# EAGLE design FLYTE-v1 (EAGLE 9.6.2)
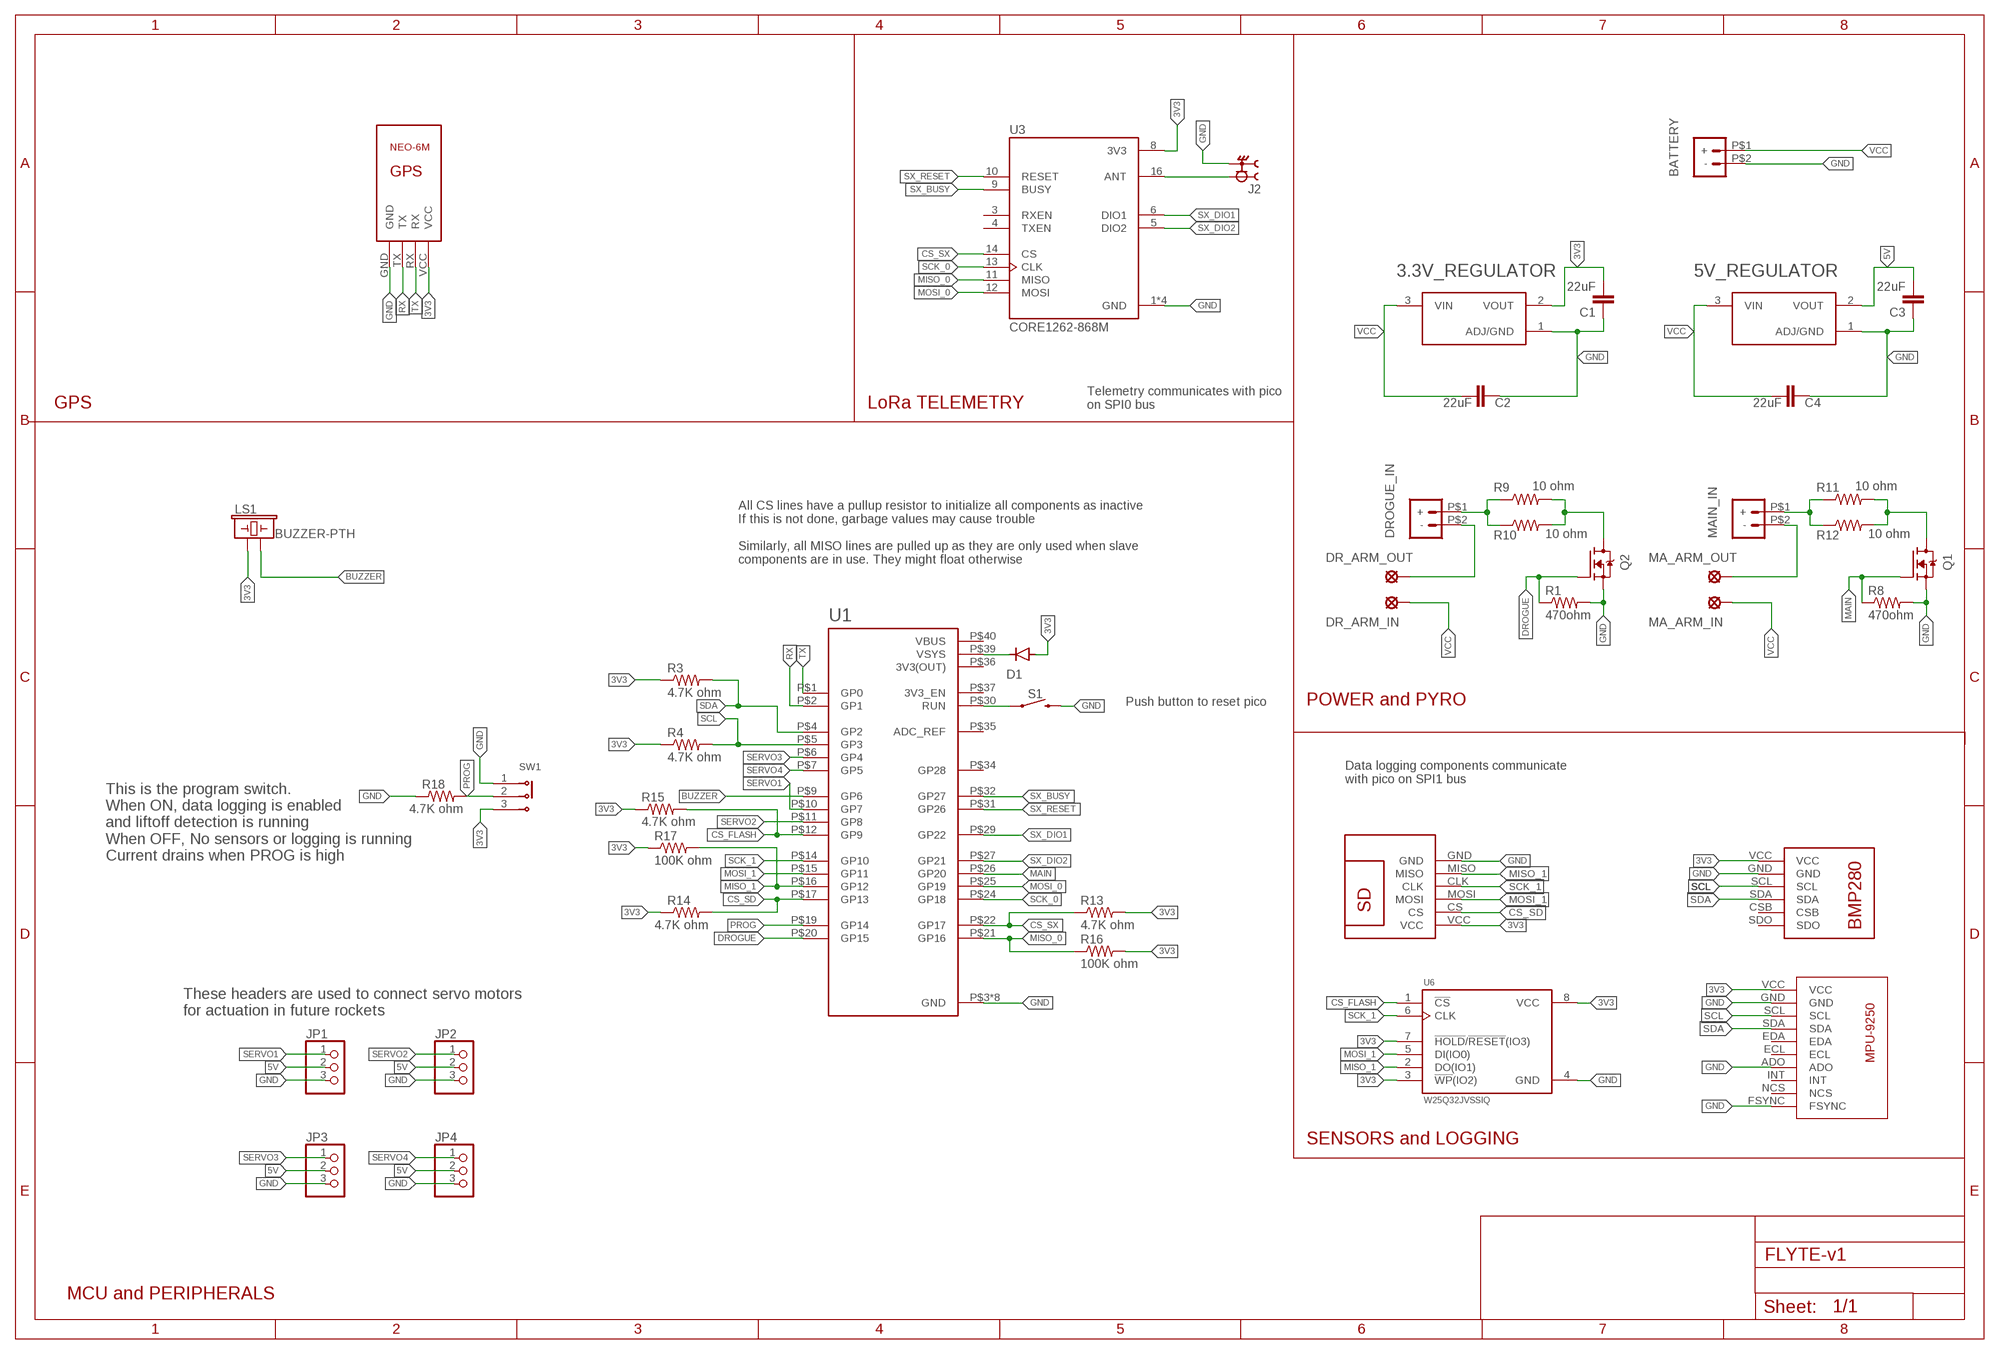
[diagram p0: schematic, sheet 1]

## Parts
3.3V_REGULATOR  AMS1117-3.3  [SOT229P700X180-4N]
5V_REGULATOR  AMS1117-3.3  [SOT229P700X180-4N]
BATTERY  XT30UPB-M  [XT30UPB-M]
C1  22uF  22UF-0805-6.3V-20%  [0805]
C2  22uF  22UF-0805-6.3V-20%  [0805]
C3  22uF  22UF-0805-6.3V-20%  [0805]
C4  22uF  22UF-0805-6.3V-20%  [0805]
D1  1N4004  [DO41-10]
DR_ARM_IN  LSP10  [LSP10]
DR_ARM_OUT  LSP10  [LSP10]
DROGUE_IN  XT30UPB-M  [XT30UPB-M]
J2  CONSMA002  [LINX_CONSMA002]
JP1  PINHD-1X3  [1X03]
JP2  PINHD-1X3  [1X03]
JP3  PINHD-1X3  [1X03]
JP4  PINHD-1X3  [1X03]
LS1  BUZZER-PTH  [BUZZER-12MM]
MA_ARM_IN  LSP10  [LSP10]
MA_ARM_OUT  LSP10  [LSP10]
MAIN_IN  XT30UPB-M  [XT30UPB-M]
Q1  IRF540NPBF  [TO254P1054X469X1930-3]
Q2  IRF540NPBF  [TO254P1054X469X1930-3]
R1  470ohm  R-US_R0805  [R0805]
R3  4.7K ohm  R-US_R0805  [R0805]
R4  4.7K ohm  R-US_R0805  [R0805]
R8  470ohm  R-US_R0805  [R0805]
R9  10 ohm  R-US_0207/10  [0207/10]
R10  10 ohm  R-US_0207/10  [0207/10]
R11  10 ohm  R-US_0207/10  [0207/10]
R12  10 ohm  R-US_0207/10  [0207/10]
R13  4.7K ohm  R-US_R0805  [R0805]
R14  4.7K ohm  R-US_R0805  [R0805]
R15  4.7K ohm  R-US_R0805  [R0805]
R16  100K ohm  R-US_R0805  [R0805]
R17  100K ohm  R-US_R0805  [R0805]
R18  4.7K ohm  R-US_R0805  [R0805]
S1  MOMENTARY-SWITCH-SPST-PTH-6.0MM  [TACTILE_SWITCH_PTH_6.0MM]
SW1  1825159-1  [SW_1825159-1]
U1  RASPBERRY_PICO-NO_DEBUG  [PICO-PKG-NO_DEBUG]
U3  CORE1262-868M  [XCVR_CORE1262-868M]
U6  W25Q32JVSSIQ  [SOIC127P790X216-8N]
U$1  BMP280  [BMP280]
U$2  GY-9250  [GY-9250]
U$3  SDREADER  [SDREADER]
U$4  NEO-6M  [NEO-6M]

## Nets
3V3: 3.3V_REGULATOR.2(VOUT) C1.2 D1.A LS1.+ R3.1 R4.1 R13.2 R14.1 R15.1 R16.2 R17.1 SW1.3 U3.8(3V3) U6.3(!WP!(IO2)) U6.7(!HOLD!/!RESET!(IO3)) U6.8(VCC) U$1.VCC U$2.VCC U$3.VCC U$4.VCC
5V: 5V_REGULATOR.2(VOUT) C3.2 JP1.2 JP2.2 JP3.2 JP4.2
ANT: J2.1 U3.16(ANT)
BUZZER: LS1.- U1.P$9(GP6)
CS_FLASH: R15.2 U1.P$12(GP9) U6.1(!CS)
CS_SD: R14.2 U1.P$17(GP13) U$3.CS
CS_SX: R13.1 U1.P$22(GP17) U3.14(CS)
DROGUE: Q2.1(G) R1.1 U1.P$20(GP15)
GND: 3.3V_REGULATOR.1(ADJ/GND) 5V_REGULATOR.1(ADJ/GND) BATTERY.P$2(-) C1.1 C2.1 C3.1 C4.1 J2.S1 J2.S2 J2.S3 J2.S4 JP1.3 JP2.3 JP3.3 JP4.3 Q1.3(S) Q2.3(S) R1.2 R8.2 R18.1 S1.3 SW1.1 U1.P$3(GND) U1.P$8(GND) U1.P$13(GND) U1.P$18(GND) U1.P$23(GND) U1.P$28(GND) U1.P$33(GND) U1.P$38(GND) U3.1(GND) U3.2(GND) U3.7(GND) U3.15(GND) U6.4(GND) U$1.GND U$2.ADO U$2.FSYNC U$2.GND U$3.GND U$4.GND
MAIN: Q1.1(G) R8.1 U1.P$26(GP20)
MISO_0: R16.1 U1.P$21(GP16) U3.11(MISO)
MISO_1: R17.2 U1.P$16(GP12) U6.2(DO(IO1)) U$3.MISO
MOSI_0: U1.P$25(GP19) U3.12(MOSI)
MOSI_1: U1.P$15(GP11) U6.5(DI(IO0)) U$3.MOSI
N$1: D1.C U1.P$39(VSYS)
N$2: DR_ARM_OUT.MP DROGUE_IN.P$2(-)
N$6: MAIN_IN.P$1(+) R11.1 R12.1
N$7: DROGUE_IN.P$1(+) R9.1 R10.1
N$8: S1.1 U1.P$30(RUN)
N$12: Q2.2(D) R9.2 R10.2
N$13: Q1.2(D) R11.2 R12.2
N$14: MA_ARM_OUT.MP MAIN_IN.P$2(-)
PROG: R18.2 SW1.2 U1.P$19(GP14)
RX: U1.P$2(GP1) U$4.TX
SCK_0: U1.P$24(GP18) U3.13(CLK)
SCK_1: U1.P$14(GP10) U6.6(CLK) U$3.CLK
SCL: R4.2 U1.P$5(GP3) U$1.SCL U$2.SCL
SDA: R3.2 U1.P$4(GP2) U$1.SDA U$2.SDA
SERVO1: JP1.1 U1.P$10(GP7)
SERVO2: JP2.1 U1.P$11(GP8)
SERVO3: JP3.1 U1.P$6(GP4)
SERVO4: JP4.1 U1.P$7(GP5)
SX_BUSY: U1.P$32(GP27) U3.9(BUSY)
SX_DIO1: U1.P$29(GP22) U3.6(DIO1)
SX_DIO2: U1.P$27(GP21) U3.5(DIO2)
SX_RESET: U1.P$31(GP26) U3.10(RESET)
TX: U1.P$1(GP0) U$4.RX
VCC: 3.3V_REGULATOR.3(VIN) 5V_REGULATOR.3(VIN) BATTERY.P$1(+) C2.2 C4.2 DR_ARM_IN.MP MA_ARM_IN.MP
Unconnected: U1.P$34(GP28) U1.P$35(ADC_REF) U1.P$37(3V3_EN) U3.3(RXEN) U3.4(TXEN) U$1.CSB U$1.SDO U$2.ECL U$2.EDA U$2.INT U$2.NCS

## Notes on the sheet
- GPS | LoRa TELEMETRY
- Telemetry communicates with pico 
  on SPI0 bus
- All CS lines have a pullup resistor to initialize all components as inactive
  If this is not done, garbage values may cause trouble
  
  Similarly, all MISO lines are pulled up as they are only used when slave
  components are in use. They might float otherwise
- Push button to reset pico | POWER and PYRO
- Data logging components communicate 
  with pico on SPI1 bus
- This is the program switch.
  When ON, data logging is enabled 
  and liftoff detection is running
  When OFF, No sensors or logging is running
  Current drains when PROG is high
- These headers are used to connect servo motors 
  for actuation in future rockets
- SENSORS and LOGGING
- MCU and PERIPHERALS

## Power pins joined to a net without a drawn wire
3V3(OUT): U1.P$36(3V3(OUT))
VBUS: U1.P$40(VBUS)

## Library data of the parts
3.3V_REGULATOR 5V_REGULATOR = AMS1117-3.3:AMS1117-3.3: Sot223/Pkg 1-Amp 3.3-Volt Low Drop Out Voltage Regulatator Check availability <https://pricing.snapeda.com/parts/AMS1117-3.3/Advanced%20Monolithic%20Systems/view-part?ref=eda>; AVAILABILITY: Not in stock; DESCRIPTION: Sot223/Pkg 1-Amp 3.3-Volt Low Drop Out Voltage Regulatator; MF: Advanced Monolithic Systems; MP: AMS1117-3.3; PACKAGE: SOT-223 Seeed Technology; PRICE: None
BATTERY DROGUE_IN MAIN_IN = XT30UPB-M:XT30UPB-M: Check availability <https://pricing.snapeda.com/parts/XT30UPB-M/amass/view-part?ref=eda>; AVAILABILITY: Not in stock; DESCRIPTION: Socket; DC supply; XT30; male; PIN: 2; on PCBs; THT; yellow; 15A; 500V; MF: amass; MP: XT30UPB-M; PACKAGE: None; PRICE: None
C1-C4 = SparkFun-Capacitors:22UF: 22µF ceramic capacitors A capacitor is a passive two-terminal electrical component used to store electrical energy temporarily in an electric field.; PROD_ID: CAP-08402
D1 = diode:1N4004: DIODE general purpose rectifier, 1 A
DR_ARM_IN DR_ARM_OUT MA_ARM_IN MA_ARM_OUT = solpad:LSP10: SOLDER PAD drill 1.0 mm, distributor Buerklin, 12H555
J2 = CONSMA002:CONSMA002: Check availability <https://pricing.snapeda.com/parts/CONSMA002/Linx/view-part?ref=eda>; AVAILABILITY: In Stock; DESCRIPTION: SMA Connector Receptacle, Female Socket 50Ohm Through Hole, Right Angle Solder; MF: Linx; MP: CONSMA002; PACKAGE: None; PRICE: None; PURCHASE-URL: https://pricing.snapeda.com/search/part/CONSMA002/?ref=eda
JP1-JP4 = adafruit:PINHD-1X3: PIN HEADER
LS1 = SparkFun-Electromechanical:BUZZER: Buzzer Small round buzzers that operate around the audible 2kHz range. You can use these as speakers to create simple music or user interfaces. Variant Overview: PTH - Mini Speaker - PC Mount 12mm 2.048kHz <https://www.sparkfun.com/products/7950> PTH_KIT - Mini Speaker - PC Mount 12mm 2.048kHz <https://www.sparkfun.com/products/7950> KIT simplifies soldering by adding stop mask to one side of the pads. PTH_NO_SILK - Mini Speaker - PC Mount 12mm 2.048kHz <https://www.sparkfun.com/products/7950> No silkscreen indicator of buzzer outline. PTH_KIT_NO_SILK - Mini Speaker - PC Mount 12mm 2.048kHz <https://www.sparkfun.com/products/7950> KIT package w/o silkscreen SMD - Buzzer Audio Magnetic (CCV-084B16) SMD buzzer used on, e.g. the LilyPad Buzzer <https://www.sparkfun.com/products/8463> and RFID USB Reader <https://www.sparkfun.com/products/9963>. SMD_KIT - Buzzer Audio Magnetic (CCV-084B16) SMD Buzzer with elongated pins to make soldering easier. Used on the SparkFun Simon Says - Surface Mount Soldering Kit <https://www.sparkfun.com/products/10935>. SMD-SQUARE - Buzzer Audio Magnetic (COMP-15701) SMT square buzzer with one chamfered corner.; PROD_ID: COMP-08253; SF_SKU: COM-07950
Q1 Q2 = IRF540NPBF:IRF540NPBF: Check availability <https://pricing.snapeda.com/parts/IRF540NPBF/Infineon/view-part?ref=eda>; AVAILABILITY: In Stock; DESCRIPTION: RoHS Compliant | Low RDS(on) | Industry-leading quality | Dynamic dv/dt Rating | Fast Switching | Fully Avalanche Rated | 175C Operating Temperature; MF: Infineon; MP: IRF540NPBF; PACKAGE: TO-220 Infineon; PRICE: None; PURCHASE-URL: https://pricing.snapeda.com/search/part/IRF540NPBF/?ref=eda
R1 R3 R4 R8-R18 = rcl:R-US_: RESISTOR, American symbol; SPICEPREFIX: R
S1 = SparkFun-Switches:MOMENTARY-SWITCH-SPST: Momentary Switch (Pushbutton) - SPST Normally-open (NO) SPST momentary switches (buttons, pushbuttons). Variants PTH-12MM - 12mm square, through-hole Momentary Pushbutton Switch - 12mm Square <https://www.sparkfun.com/products/9190> (COM-09190) PTH-6.0MM, PTH-6.0MM-KIT - 6.0mm square, through-hole Mini Pushbutton Switch <https://www.sparkfun.com/products/97> (COM-00097) KIT package intended for soldering kit's - only one side of pads' copper is exposed. PTH-RIGHT-ANGLE-KIT - Right-angle, through-hole Right Angle Tactile Button <https://www.sparkfun.com/products/10791> - Used on SparkFun BigTime Watch Kit <https://www.sparkfun.com/products/11734> SMD-12MM - 12mm square, surface-mount Tactile Button - SMD (12mm) <https://www.sparkfun.com/products/12993> (COM-12993) Used on SparkFun PicoBoard <https://www.sparkfun.com/products/11888> SMD-4.5MM - 4.5mm Square Trackball Switch Used on SparkFun Blackberry Trackballer Breakout <https://www.sparkfun.com/products/13169> SMD-4.6MMX2.8MM - 4.60mm x 2.80mm, surface mount Used on SparkFun Pro Micro - RP2040 <https://www.sparkfun.com/products/17717> SMD-5.2MM, SMD-5.2-REDUNDANT - 5.2mm square, surface-mount Mini Pushbutton Switch - SMD <https://www.sparkfun.com/products/8720> (COM-08720) Used on Arduino Pro Mini <https://www.sparkfun.com/products/11114> REDUNDANT package connects both switch circuits together SMD-6.0X3.5MM - 6.0 x 3.5mm, surface mount Momentary Reset Switch SMD <https://www.sparkfun.com/products/8229> (COM-08229) SMD-6.2MM-TALL - 6.2mm square, surface mount Tactile Button - SMD (6mm) <https://www.sparkfun.com/products/12992> Used on SparkFun Digital Sandbox <https://www.sparkfun.com/products/12651> SMD-RIGHT-ANGLE - Right-angle, surface mount Used on SparkFun Block for Intel® Edison - Arduino <https://www.sparkfun.com/products/13036>; PROD_ID: SWCH-08441; SF_SKU: COM-00097
SW1 = 1825159-1:1825159-1: SWITCH SLIDE SPDT 300MA 125V Check availability <https://pricing.snapeda.com/parts/1825159-1/TE%20Connectivity/view-part?ref=eda>; AVAILABILITY: In Stock; COMMENT: 1825159-1; CONFIGURATION_POLE-THROW: Single Pole - Double Throw; CONTACT_CURRENT_RATING: .25 A; DESCRIPTION: Slide Switch SPDT Through Hole; EU_ROHS_COMPLIANCE: Compliant; MF: TE Connectivity; MP: 1825159-1; PACKAGE: None; PRICE: None; PURCHASE-URL: https://pricing.snapeda.com/search/part/1825159-1/?ref=eda; SWITCH_TYPE: Slide
U1 = RpiPico:RASPBERRY_PICO-NO_DEBUG
U3 = CORE1262-868M:CORE1262-868M: Check availability <https://pricing.snapeda.com/parts/Core1262-868M/Waveshare%20Electronics/view-part?ref=eda>; AVAILABILITY: Not in stock; DESCRIPTION: Lora core module; MF: Waveshare Electronics; MP: Core1262-868M; PACKAGE: Package; PRICE: None
U6 = W25Q32JVSSIQ:W25Q32JVSSIQ: NOR Flash Serial-SPI 3V/3.3V 32M-bit 4M x 8 8.5ns 8-Pin SOIC Check availability <https://pricing.snapeda.com/parts/W25Q32JVSSIQ/Winbond/view-part?ref=eda>; AVAILABILITY: In Stock; DESCRIPTION: FLASH - NOR Memory IC 32Mb (4M x 8) SPI - Quad I/O 133 MHz 8-SOIC; MF: Winbond; MP: W25Q32JVSSIQ; PACKAGE: SOIC-8 Winbond; PRICE: None; PURCHASE-URL: https://pricing.snapeda.com/search/part/W25Q32JVSSIQ/?ref=eda
U$1 = BMP280:BMP280
U$2 = GY-9250:GY-9250
U$3 = SDREADER:SDREADER
U$4 = NEO-6M:NEO-6M

## Board
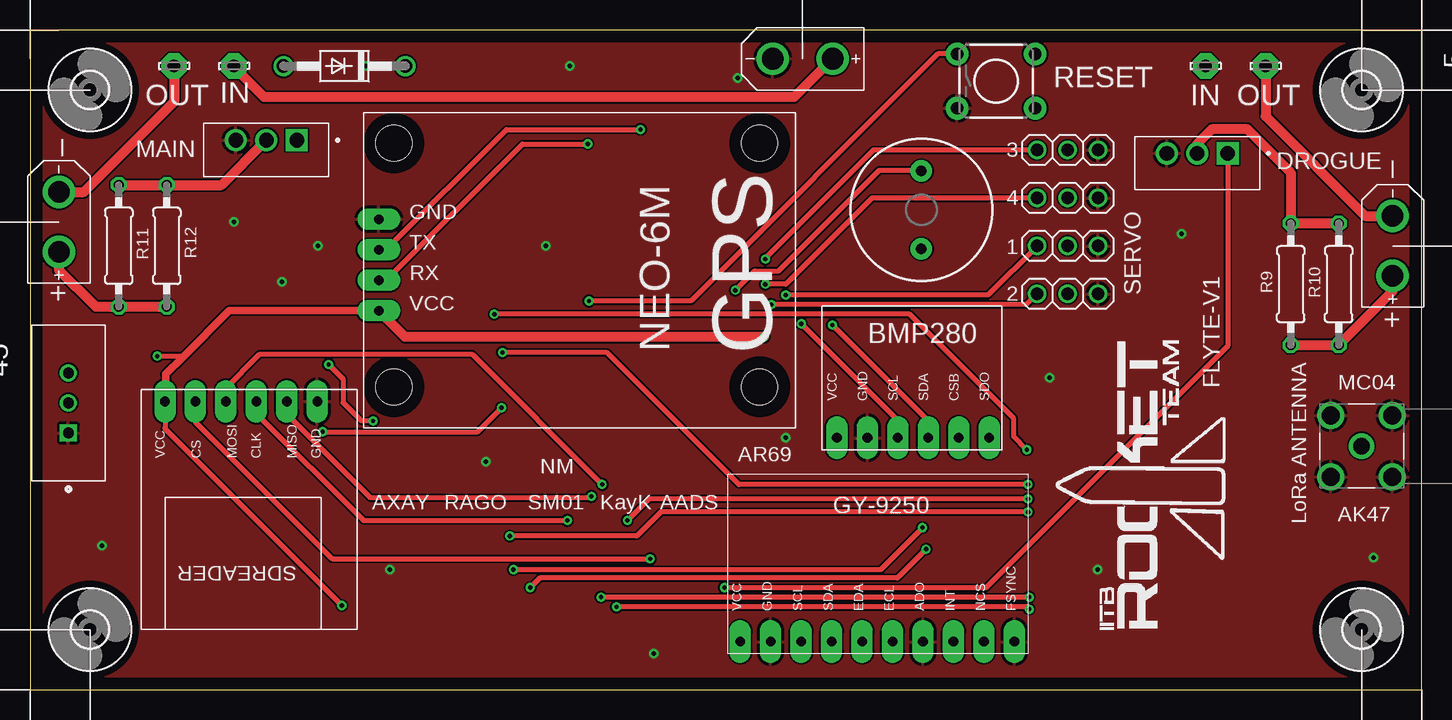
[diagram p1: board, top side]
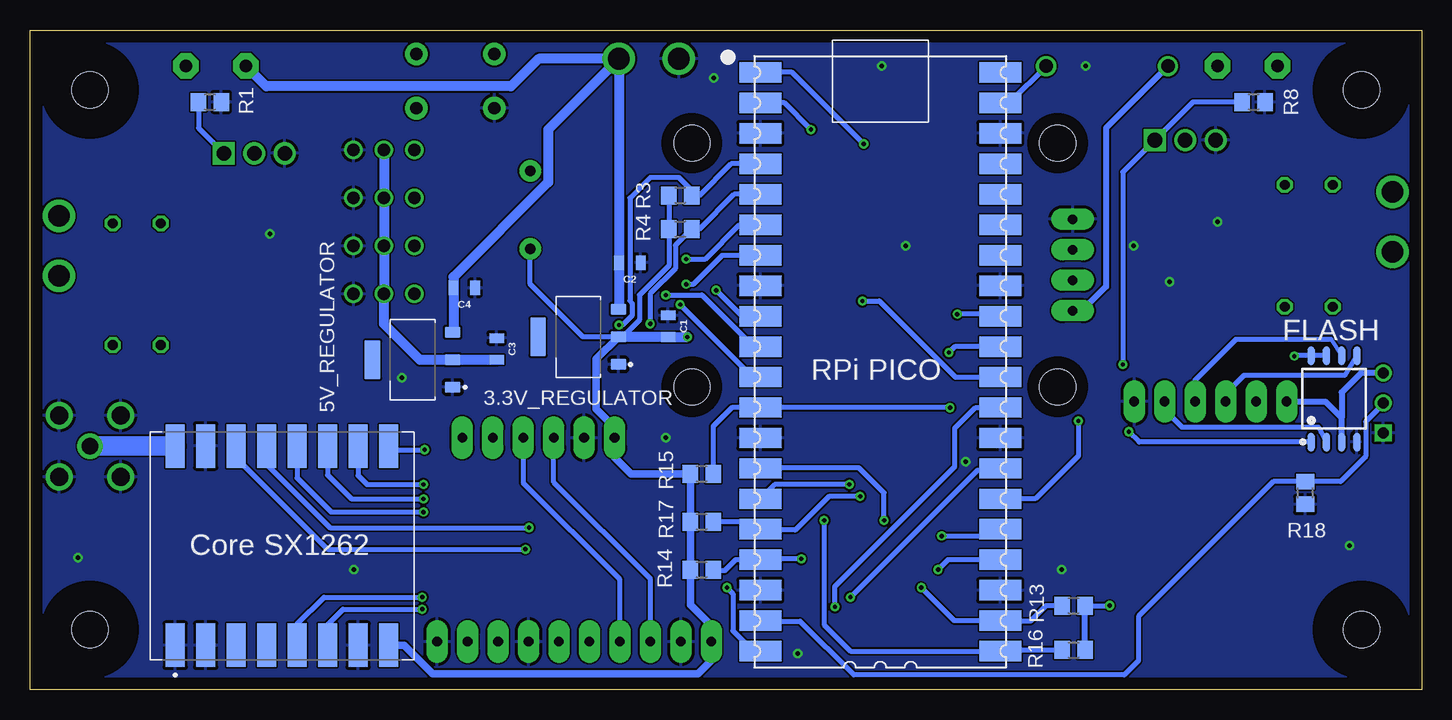
[diagram p2: board, bottom side, seen from below]

Size 116 x 55 mm. Coordinates in mm from the lower left corner, seen from the top.
Outline: 0,0 116,0 116,55 0,55 0,0
Copper layers (1*16): Top 0.035mm / dielectric 1.5mm / Bottom 0.035mm
Design rules "default": minimum track width 6mil, minimum drill 0.35mm, track to track 6mil, track to pad 6mil, pad to pad 6mil, via to via 6mil, smd to smd 6mil, copper to edge 40mil, drill to drill 6mil, minimum pad ring 10mil, minimum via ring 8mil, stop-mask expansion 4mil, vias tented up to drill 0mil, thermal gap 10mil

### Footprints (pad centres in the part's own frame; a part is rotated, then mirrored left to right if it is on the bottom)
SOT229P700X180-4N = smd 0.93 x 1.31: 1 -2.29,-3.345; 2 0,-3.345; 3 2.29,-3.345 | smd 3.24 x 1.31: 4 0,3.345
XT30UPB-M = drill 1.8: P$1 -2.5,0; P$2 2.5,0
0805 = smd 0.8 x 1.2: 1 -0.9,0; 2 0.9,0
DO41-10 = drill 1.118: A 5.08,0; C -5.08,0
LSP10 = drill 1.016 pad 2.159 octagon: MP 0,0
LINX_CONSMA002 = drill 1.4: 1 0,0 | drill 1.5: S1 -2.55,2.55; S2 -2.55,-2.55; S3 2.55,-2.55; S4 2.55,2.55
1X03 = drill 1.016: 1 -2.54,0; 2 0,0; 3 2.54,0
BUZZER-12MM = drill 0.9 pad 1.778: + 3.25,0; - -3.25,0
TO254P1054X469X1930-3 = drill 1.23 square: 1 -2.54,-0.81 | drill 1.23: 2 0,-0.81; 3 2.54,-0.81
R0805 = smd 1.3 x 1.5: 1 -0.95,0; 2 0.95,0
0207/10 = drill 0.813 octagon: 1 -5.08,0; 2 5.08,0
TACTILE_SWITCH_PTH_6.0MM = drill 1.016 pad 1.88: 1 -3.251,2.261; 2 3.251,2.261; 3 -3.251,-2.261; 4 3.251,-2.261
SW_1825159-1 = drill 0.9 square: 1 -2.5,0 | drill 0.9: 2 0,0; 3 2.5,0
PICO-PKG-NO_DEBUG = smd 3.5 x 1.7: P$1 -8.73,25.4; P$2 -8.73,22.86; P$3 -8.73,20.32; P$4 -8.73,17.78; P$5 -8.73,15.24; P$6 -8.73,12.7; P$7 -8.73,10.16; P$8 -8.73,7.62; P$9 -8.73,5.08; P$10 -8.73,2.54; P$11 -8.73,0; P$12 -8.73,-2.54; P$13 -8.73,-5.08; P$14 -8.73,-7.62; P$15 -8.73,-10.16; P$16 -8.73,-12.7; P$17 -8.73,-15.24; P$18 -8.73,-17.78; P$19 -8.73,-20.32; P$20 -8.73,-22.86; P$21 11.27,-22.86; P$22 11.27,-20.32; P$23 11.27,-17.78; P$24 11.27,-15.24; P$25 11.27,-12.7; P$26 11.27,-10.16; P$27 11.27,-7.62; P$28 11.27,-5.08; P$29 11.27,-2.54; P$30 11.27,0; P$31 11.27,2.54; P$32 11.27,5.08; P$33 11.27,7.62; P$34 11.27,10.16; P$35 11.27,12.7; P$36 11.27,15.24; P$37 11.27,17.78; P$38 11.27,20.32; P$39 11.27,22.86; P$40 11.27,25.4
XCVR_CORE1262-868M = smd 3.61 x 1.61: 1 -8.3,8.89; 2 -8.3,6.35; 3 -8.3,3.81; 4 -8.3,1.27; 5 -8.3,-1.27; 6 -8.3,-3.81; 7 -8.3,-6.35; 8 -8.3,-8.89; 9 8.3,-8.89; 10 8.3,-6.35; 11 8.3,-3.81; 12 8.3,-1.27; 13 8.3,1.27; 14 8.3,3.81; 15 8.3,6.35; 16 8.3,8.89
SOIC127P790X216-8N = smd 1.6 x 0.6: 1 -3.6,1.905; 2 -3.6,0.635; 3 -3.6,-0.635; 4 -3.6,-1.905; 5 3.6,-1.905; 6 3.6,-0.635; 7 3.6,0.635; 8 3.6,1.905
BMP280 = drill 0.8 pad 1.778 long: CSB 11.43,1; GND 3.81,1; SCL 6.35,1; SDA 8.89,1; SDO 13.97,1; VCC 1.27,1
GY-9250 = drill 0.799 pad 1.778 long: ADO 1,8.76; ECL 1,11.3; EDA 1,13.84; FSYNC 1,1.14; GND 1,21.46; INT 1,6.22; NCS 1,3.68; SCL 1,18.92; SDA 1,16.38; VCC 1,24
SDREADER = drill 0.8 pad 1.778 long: CLK 1,9.62; CS 1,4.54; GND 1,14.7; MISO 1,12.16; MOSI 1,7.08; VCC 1,2
NEO-6M = drill 0.8 pad 1.778 long: GND 8.89,1.27; RX 13.97,1.27; TX 11.43,1.27; VCC 16.51,1.27 | hole 3: 2.54,2.54; 22.86,2.54; 2.54,33.02; 22.86,33.02
3,0 = hole 3: 0,0

### Placement (x,y rotation side)
3.3V_REGULATOR  70.3,29.4 90 bottom
5V_REGULATOR  84.1,27.5 90 bottom
BATTERY  64.4,52.6 180 top
C1  62.8,30.3 270 bottom
C2  66,35.6 180 bottom
C3  77.1,28.4 270 bottom
C4  79.8,33.5 180 bottom
D1  26.21,51.99 180 top
DR_ARM_IN  98,52 0 top
DR_ARM_OUT  103,52 0 top
DROGUE_IN  113.6,37 90 top
J2  111,20.3 90 top
JP1  86.5,37 0 top
JP2  86.5,33 0 top
JP3  86.5,45 0 top
JP4  86.5,41 0 top
LS1  74.3,40 270 top
MA_ARM_IN  17,52 0 top
MA_ARM_OUT  12,52 0 top
MAIN_IN  2.4,39 90 top
Q1  19.7,45 180 top
Q2  97.3,43.9 180 top
R1  101,49 0 bottom
R3  61.8,41.2 0 bottom
R4  61.8,38.4 0 bottom
R8  14,49 0 bottom
R9  105.1,33.8 90 top
R10  109.1,33.8 90 top
R11  7.4,37 90 top
R12  11.4,37 90 top
R13  29,7 0 bottom
R14  60,10 0 bottom
R15  60,18 0 bottom
R16  29,3.3 0 bottom
R17  60,14 0 bottom
R18  9.69,16.4 90 bottom
S1  80.54,50.74 0 top
SW1  3.2,23.9 90 top
U1  46.39,26.06 0 bottom
U3  95,12 90 bottom
U6  7.3,24.24 90 bottom
U$1  66,20 0 top
U$2  83.2,3 90 top
U$3  9.25,25.02 270 top
U$4  27.8,48.1 270 top
U$5  [3,0]  5,50 0 top
U$6  [3,0]  111,50 0 top
U$7  [3,0]  111,5 0 top
U$8  [3,0]  5,5 0 top

### Tracks (layer width: path | path; a pad name or v marks a point on that pad's centre or on a via)
3V3  (via drill 0.35)
  Top 0.406: v10.6,27.8 12.7,27.8 12.75,27.75 | U$3.VCC 11.25,21.85 11.25,21.75 v26,7
  Top 0.61: U$4.VCC 16.59,31.59 12.75,27.75 11.3,26.3 11.3,24.07 U$3.VCC
  Top 0.813: v61.2,29.4 31.26,29.4 U$4.VCC
  Bottom 0.406: R3.1 R4.1 62.75,35.35 65.2,32.9 65.2,30.8 66.6,29.4 3.3V_REGULATOR.2 69.9,29.4 74.3,33.8 LS1.+ | R13.2 v26,7 | U6.7 U6.8 10.56,27.84 v10.6,27.8
  Bottom 0.508: U6.3 6.67,22.66 | U$3.VCC 8.02,24.02 6.67,22.66 | SW1.3 5.04,26.4 6.67,24.77 6.67,22.66 | D1.A 26.3,46.82 26.3,33.6 28.31,31.59 U$4.VCC | R16.2 R13.2
  Bottom 0.61: 3.3V_REGULATOR.2 68.8,27.55 68.8,23.4 67.27,21.87 U$1.VCC 67.27,19.37 65.9,18 R15.1 R17.1 R14.1 60.95,7.05 59.2,5.3 U$2.VCC 59.2,2.42 60.3,1.32 82.43,1.32 84.81,3.7 U3.8
  Bottom 0.813: 3.3V_REGULATOR.2 C1.2 v61.2,29.4
5V
  Bottom 0.813: C3.2 5V_REGULATOR.2 83.5,27.5 86.5,30.5 JP2.2 JP1.2 JP4.2 JP3.2
ANT
  Bottom 1.62: U3.16 J2.1
BUZZER  (via drill 0.35)
  Top 0.406: v58.8,33.3 60.4,34.9 62.4,34.9 70.8,43.3 74.25,43.3 LS1.-
  Bottom 0.406: U1.P$9 56.64,31.14 v58.8,33.3
CS_FLASH  (via drill 0.35)
  Top 0.406: v24.4,21.5 37.3,21.5 v39.3,23.5
  Bottom 0.406: R15.2 59.05,21.95 57.48,23.52 U1.P$12 39.32,23.52 v39.3,23.5 | U6.1 23.54,20.64 v24.4,21.5
CS_SD  (via drill 0.35)
  Top 0.406: U$3.CS 13.79,22.31 25.2,10.9 v51.7,10.9
  Bottom 0.406: R14.2 58.95,9.9 58.1,9.9 57.18,10.82 U1.P$17 55.04,10.9 v51.7,10.9
CS_SX  (via drill 0.35)
  Top 0.406: v74.7,11.7 72.3,9.3 42.5,9.3 v41.7,8.5
  Bottom 0.406: R13.1 31.3,7 32.6,5.7 35.08,5.7 U1.P$22 38.94,5.74 v41.7,8.5 | U3.14 98.81,19.31 91.2,11.7 v74.7,11.7
DROGUE  (via drill 0.35)
  Top 0.406: Q2.1 99.84,28.64 79.7,8.5 v57.9,8.5
  Bottom 0.406: R1.1 101.95,46.82 Q2.1 | U1.P$20 55.7,3.2 57.4,4.9 57.4,8 v57.9,8.5
GND  (via drill 0.35)
  other vias: 28,52 45,52 59,51 96,38 85,26 89,10 112,11 63,21 38,19 30,10 52,3 6,12 21,34 24,37 17,39 43,37
  pour Top: 0,55.1 0,-0.1 116.1,-0.1 116.1,55.1
  pour Bottom: -0.1,55.1 -0.1,-0.1 116.2,-0.1 116.2,55.1
MAIN  (via drill 0.35)
  Top 0.406: v24.9,27.1 26.1,25.9 26.1,23.93 27.63,22.4 v28.6,22.4
  Bottom 0.406: R8.1 19.05,49 Q1.1 24.9,43.15 v24.9,27.1 | v28.6,22.4 28.6,19.5 32.2,15.9 U1.P$26
MISO_0  (via drill 0.35)
  Top 0.406: v83.2,15.9 51.6,15.9 v49.8,14.1
  Bottom 0.406: R16.1 35.02,3.3 U1.P$21 47.6,3.2 49.8,5.4 v49.8,14.1 | U3.11 91.19,17.89 89.2,15.9 v83.2,15.9
MISO_1  (via drill 0.35)
  Top 0.406: v46.8,16.1 46.7,16 28.4,16 22.45,21.95 21.41,22.99 U$3.MISO
  Bottom 0.406: R17.2 55.76,14 U1.P$16 55.06,13.3 52.2,13.3 49.4,16.1 v46.8,16.1 | U$3.MISO 21.41,23.3 20,21.89 8.6,21.89 8.37,21.47 U6.2
MOSI_0  (via drill 0.35)
  Top 0.406: v83.2,14.8 52.6,14.8 50.6,12.8 v40,12.8
  Bottom 0.406: U3.12 93.73,17.63 90.9,14.8 v83.2,14.8 | v40,12.8 35.68,12.8 U1.P$25
MOSI_1  (via drill 0.35)
  Top 0.406: U$3.MOSI 16.33,24.23 16.24,25.04 19.16,27.96 36.84,27.96 v47.7,17.1
  Bottom 0.406: U6.5 6.41,26.2 14.8,26.2 16.33,24.67 U$3.MOSI | v47.7,17.1 53.92,17.1 U1.P$15
N$1
  Bottom 0.406: D1.C 34.36,48.92 U1.P$39
N$2
  Top 0.813: DR_ARM_OUT.MP 103,47.8 111.3,39.5 DROGUE_IN.P$2
N$6
  Top 0.813: R12.1 R11.1 5.48,31.92 2.4,35 MAIN_IN.P$1
N$7
  Top 0.813: R9.1 R10.1 113.6,33.22 DROGUE_IN.P$1
N$8  (via drill 0.35)
  Top 0.406: S1.1 75.69,53 55.09,32.4 v46.6,32.4
  Bottom 0.406: v46.6,32.4 45.2,32.4 38.86,26.06 U1.P$30
N$12
  Top 0.813: R10.2 R9.2 105.1,43.1 101.49,46.71 98.5,46.71 97.3,45.51 Q2.2
N$13
  Top 0.813: R11.2 R12.2 15.97,42.08 Q1.2
N$14
  Top 0.813: MA_ARM_OUT.MP 12,49 4.5,41.5 MAIN_IN.P$2
PROG
  Bottom 0.406: SW1.2 3.7,23.31 4.66,22.35 4.66,19.44 6.75,17.35 R18.2 12.35,17.35 23.6,6.1 23.6,2.4 24.78,1.22 47.32,1.22 51.8,5.7 55.6,5.7 55.56,5.74 U1.P$19
RX  (via drill 0.35)
  Top 0.406: U$4.TX 29.68,36.67 39.71,46.7 v50.9,46.7
  Bottom 0.406: v50.9,46.7 53.12,48.92 U1.P$2
SCK_0  (via drill 0.35)
  Top 0.406: v74.4,13.5 70.9,10 v40.3,10
  Bottom 0.406: U3.13 96.27,18.77 91,13.5 v74.4,13.5 | U1.P$24 39.48,10.82 v40.3,10
SCK_1  (via drill 0.35)
  Top 0.406: U$3.CLK 18.87,23.03 27.8,14.1 v44.8,14.1
  Bottom 0.305: U6.6 7.53,29.2
  Bottom 0.406: 7.53,29.2 15.5,29.2 18.87,25.83 U$3.CLK | v44.8,14.1 44.8,16.4 46.9,18.5 55.06,18.5 U1.P$14
SCL  (via drill 0.35)
  Top 0.406: v64.3,30.5 72.35,22.45 U$1.SCL
  Bottom 0.406: U1.P$5 57.3,41.3 60.2,38.4 R4.2 61.74,37.51 61.74,37.5 62.19,37.06 62.19,35.12 64.3,33.01 v64.3,30.5 | U$1.SCL 72.35,17.29 64.28,9.22 U$2.SCL
SDA  (via drill 0.35)
  Top 0.406: v66.9,30.4 74.89,22.41 U$1.SDA
  Bottom 0.406: U1.P$4 57.56,43.84 60.2,41.2 R3.2 60.85,41.65 61.9,42.7 64.3,42.7 66,41 66,32.4 65.8,32.2 65.8,31.2 66.6,30.4 v66.9,30.4 | U$2.SDA 66.82,9.17 74.89,17.25 U$1.SDA
SERVO1  (via drill 0.35)
  Top 0.406: JP1.1 79.86,32.9 v63,32.9
  Bottom 0.406: v63,32.9 60,32.9 55.7,28.6 U1.P$10
SERVO2  (via drill 0.35)
  Top 0.406: JP2.1 83.06,32.1 v61.8,32.1
  Bottom 0.406: v61.8,32.1 55.76,26.06 U1.P$11
SERVO3  (via drill 0.35)
  Top 0.406: JP3.1 70.3,45 61.3,36 v61.3,35.9
  Bottom 0.406: U1.P$6 56.84,38.76 59.7,35.9 v61.3,35.9
SERVO4  (via drill 0.35)
  Top 0.406: JP4.1 70.2,41 63,33.8 v61.3,33.8
  Bottom 0.406: v61.3,33.8 60.7,33.8 58.28,36.22 U1.P$7
SX_BUSY  (via drill 0.35)
  Top 0.406: v83.1,20 82,21.1 82,22.6 73.3,31.3 v38.7,31.3
  Bottom 0.406: U3.9 85.81,20 v83.1,20 | U1.P$32 35.32,31.34 38.66,31.34 v38.7,31.3
SX_DIO1  (via drill 0.35)
  Top 0.406: v83.3,6.7 83.1,6.9 v48.9,6.9
  Bottom 0.406: U3.6 91.19,5.41 89.9,6.7 v83.3,6.7 | v48.9,6.9 48.9,8.6 38.9,18.6 38.9,21.8 37.18,23.52 U1.P$29
SX_DIO2  (via drill 0.35)
  Top 0.406: v83.3,7.7 v47.6,7.7
  Bottom 0.406: U3.5 93.73,5.47 91.5,7.7 v83.3,7.7 | v47.6,7.7 37,18.3 35.26,18.3 U1.P$27
SX_RESET  (via drill 0.35)
  Top 0.406: v83.2,17.1 59.1,17.1 48.1,28.1 v39.4,28.1
  Bottom 0.406: U3.10 88.65,17.85 87.9,17.1 v83.2,17.1 | U1.P$31 38.9,28.6 v39.4,28.1
TX  (via drill 0.35)
  Top 0.406: U$4.RX 29.68,34.13 41.05,45.5 v46.5,45.5
  Bottom 0.406: v46.5,45.5 52.46,51.46 U1.P$1
VCC
  Top 0.813: BATTERY.P$1 63.7,49.4 19.5,49.4 17,51.9 MA_ARM_IN.MP
  Bottom 0.813: 3.3V_REGULATOR.3 66.9,31.75 C2.2 BATTERY.P$1 | 5V_REGULATOR.3 80.7,29.84 C4.2 80.7,34.4 72.8,42.3 72.8,46.7 BATTERY.P$1 | BATTERY.P$1 73.6,52.6 75.9,50.3 96.3,50.3 DR_ARM_IN.MP

### Text on the board
tPlace: RESET | OUT | IN | IN | OUT | _ | MAIN | 3 | DROGUE | _ | 4 | 1 | SERVO | + | 2 | + | FLYTE-V1 | MC04 | AR69 | NM | AXAY | RAGO | SM01 | KayK | AADS | LoRa ANTENNA | AK47
bPlace: FLASH | RPi PICO | Core SX1262